# Altium schematic sheet Actuators.SchDoc
size A; DocumentNumber: 4; SheetNumber: 4; SheetTotal: 5
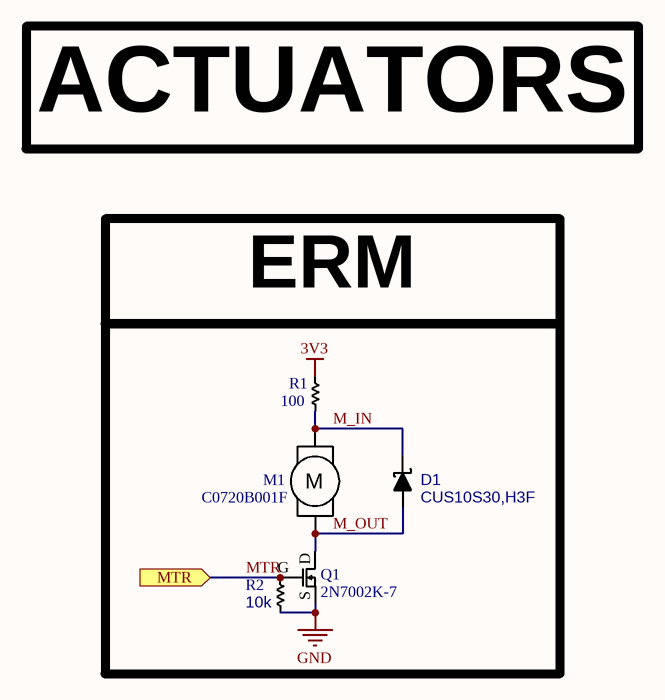
[diagram p0: Actuators.SchDoc]

## Parts
D1  CUS10S30,H3F  [CUS10S30,H3F]
M1  C0720B001F  [C0720B001F]
Q1  2N7002K-7  [2N7002K-7]
R1  100  [RES_0805_HIGH]
R2  10k  [RES_0402_HIGH]

## Ports
MTR (in)

## Nets
3V3: R1.2
GND: Q1.S R2.1
M_IN: D1.1 M1.2 R1.1
M_OUT: D1.2 M1.1 Q1.D
MTR: Q1.G R2.2 ; port MTR

## Notes on the sheet
- ACTUATORS
- (near R1) ERM
- (in symbol C0720B001F) M

## Library data of the parts
D1 = CUS10S30,H3F: CUS10S30,H3F Diode Schottky 30V 1A Surface Mount USC
M1 = C0720B001F: C0720B001F DC Motor Vibration, ERM 10000 RPM   3VDC
Q1 = 2N7002K-7: 2N7002K-7 MOSFET N-CH 60V 380MA SOT23-3
R1 = Resistor_0805: 0805 Resistor
R2 = Resistor_0402: 0402 Resistor